# EAGLE design union (EAGLE 6.4)
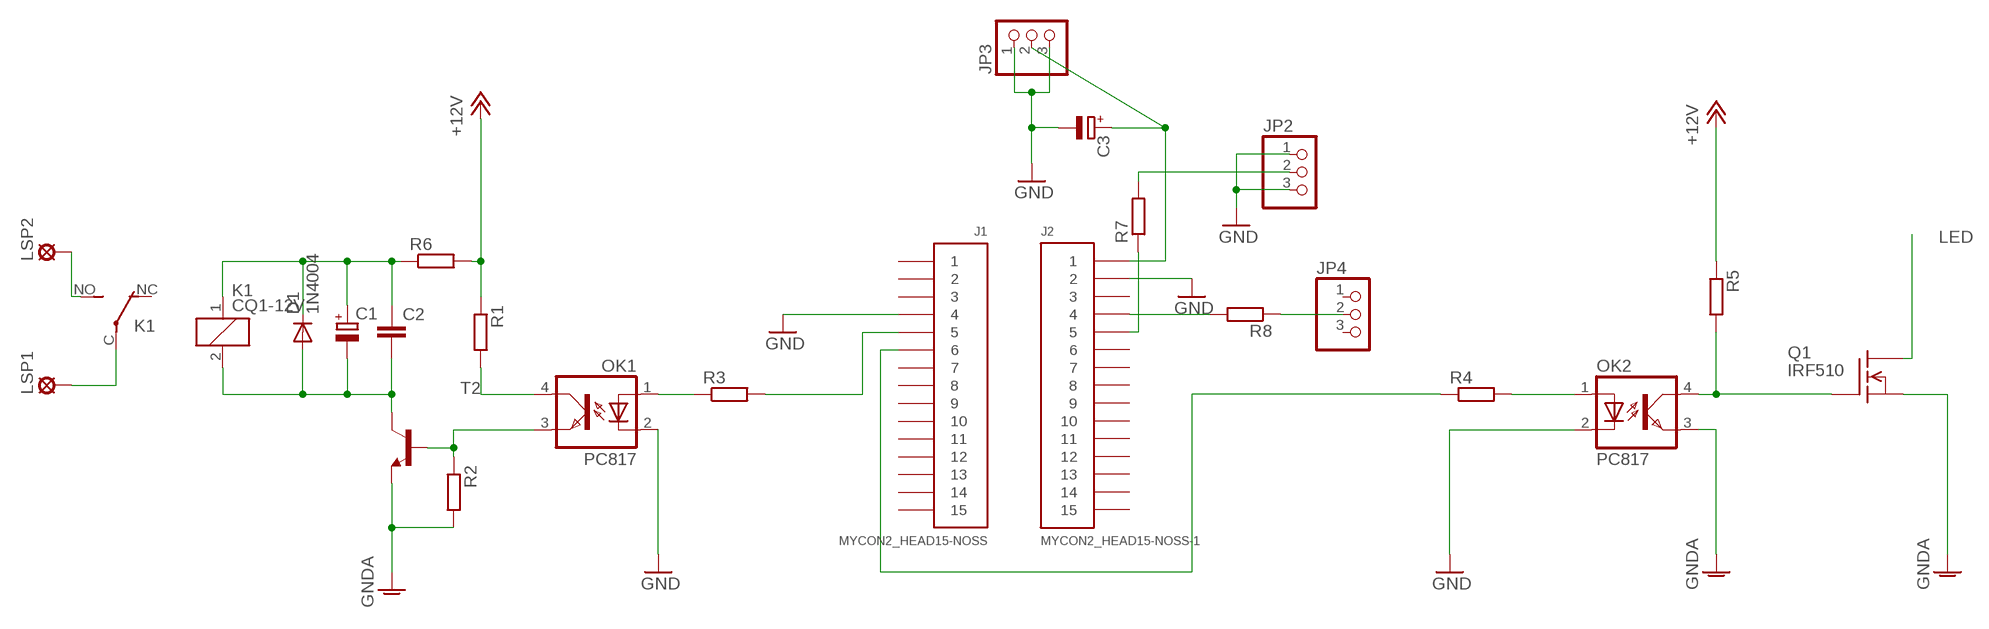
[diagram p0: schematic, sheet 1]

## Parts
C1  CPOL-EUE3.5-8  [E3,5-8]
C2  C-EUC1206  [C1206]
C3  CPOL-EUE3.5-8  [E3,5-8]
D1  1N4004  [DO41-10]
J1  MYCON2_HEAD15-NOSS  [MYCON2_HEAD15-NOSS]
J2  MYCON2_HEAD15-NOSS-1  [MYCON2_HEAD15-NOSS-1]
JP2  PINHD-1X3  [1X03]
JP3  PINHD-1X3  [1X03]
JP4  PINHD-1X3  [1X03]
K1  CQ1-12V  [CQ1]
LSP1  LSP10  [LSP10]
LSP2  LSP10  [LSP10]
OK1  PC817  [DIL04]
OK2  PC817  [DIL04]
Q1  IRF510  [TO220]
R1  R-EU_R1206  [R1206]
R2  R-EU_R1206  [R1206]
R3  R-EU_R1206  [R1206]
R4  R-EU_R1206  [R1206]
R5  R-EU_R1206  [R1206]
R6  R-EU_0204/5  [0204/5]
R7  R-EU_R1206  [R1206]
R8  R-EU_R1206  [R1206]
T2  -NPN-TO92  [TO92]

## Nets
+12V [lowpower]: R1.1 R5.1 R6.2
GND: C3.- J1.4 J2.2 JP2.1 JP2.3 JP3.1 JP3.3 OK1.2(C) OK2.2(C)
GNDA: OK2.3(EMIT) Q1.3(S) R2.2 T2.1(E)
LED [lowpower]: Q1.2(D)
N$1: OK1.3(EMIT) R2.1 T2.2(B)
N$2: C1.- C2.2 D1.A K1.2 T2.3(C)
N$3: OK1.4(COL) R1.2
N$4: OK1.1(A) R3.1
N$5: J1.6 R4.1
N$6 [power]: K1.C(2:P) LSP1.MP
N$7 [power]: K1.NO(2:S) LSP2.MP
N$8: OK2.4(COL) Q1.1(G) R5.2
N$9: OK2.1(A) R4.2
N$10: J1.5 R3.2
N$11 [lowpower]: C1.+ C2.1 D1.C K1.1 R6.1
N$12: JP2.2 R7.2
N$13: J2.4 R8.2
N$14: C3.+ J2.1 JP3.2
N$15: J2.5 R7.1
N$16: JP4.2 R8.1
Unconnected: J1.1 J1.2 J1.3 J1.7 J1.8 J1.9 J1.10 J1.11 J1.12 J1.13 J1.14 J1.15 J2.3 J2.6 J2.7 J2.8 J2.9 J2.10 J2.11 J2.12 J2.13 J2.14 J2.15 JP4.1 JP4.3 K1.NC(2:O)

## Library data of the parts
C1 C3 = rcl:CPOL-EU: POLARIZED CAPACITOR, European symbol
C2 = rcl:C-EU: CAPACITOR, European symbol
D1 = diode:1N4004: DIODE general purpose rectifier, 1 A
J1 = Arduino Nano2:MYCON2_HEAD15-NOSS
J2 = Arduino Nano2:MYCON2_HEAD15-NOSS-1
JP2-JP4 = pinhead:PINHD-1X3: PIN HEADER
K1 = relay:CQ1-12V: AUTOMOTIVE QUIET RELAY NAiS Source: http://www.mew-europe.com/.. en_ds_61208_0000.pdf; OC_FARNELL: unknown; OC_NEWARK: unknown
LSP1 LSP2 = solpad:LSP10: SOLDER PAD drill 1.0 mm, distributor Buerklin, 12H555
OK1 OK2 = optocoupler:PC817: SHARP OPTO COUPLER; MPN: PC817X4J000F; OC_FARNELL: 9707727; OC_NEWARK: 97K7059
Q1 = transistor-fet:IRF510: N-Channel Enhancement MOSFET (HEXFET); 100V; 5,6A; 0,54Ohm
R1-R5 R7 R8 = rcl:R-EU_: RESISTOR, European symbol
R6 = resistor:R-EU_: RESISTOR, European symbol
T2 = transistor:*-NPN-: NPN Transistror BF959 corrected 2008.03.06

## Net classes
0 default: width 0.559 mm
1 power: width 1.219 mm
2 lowpower: width 0.813 mm

## Board
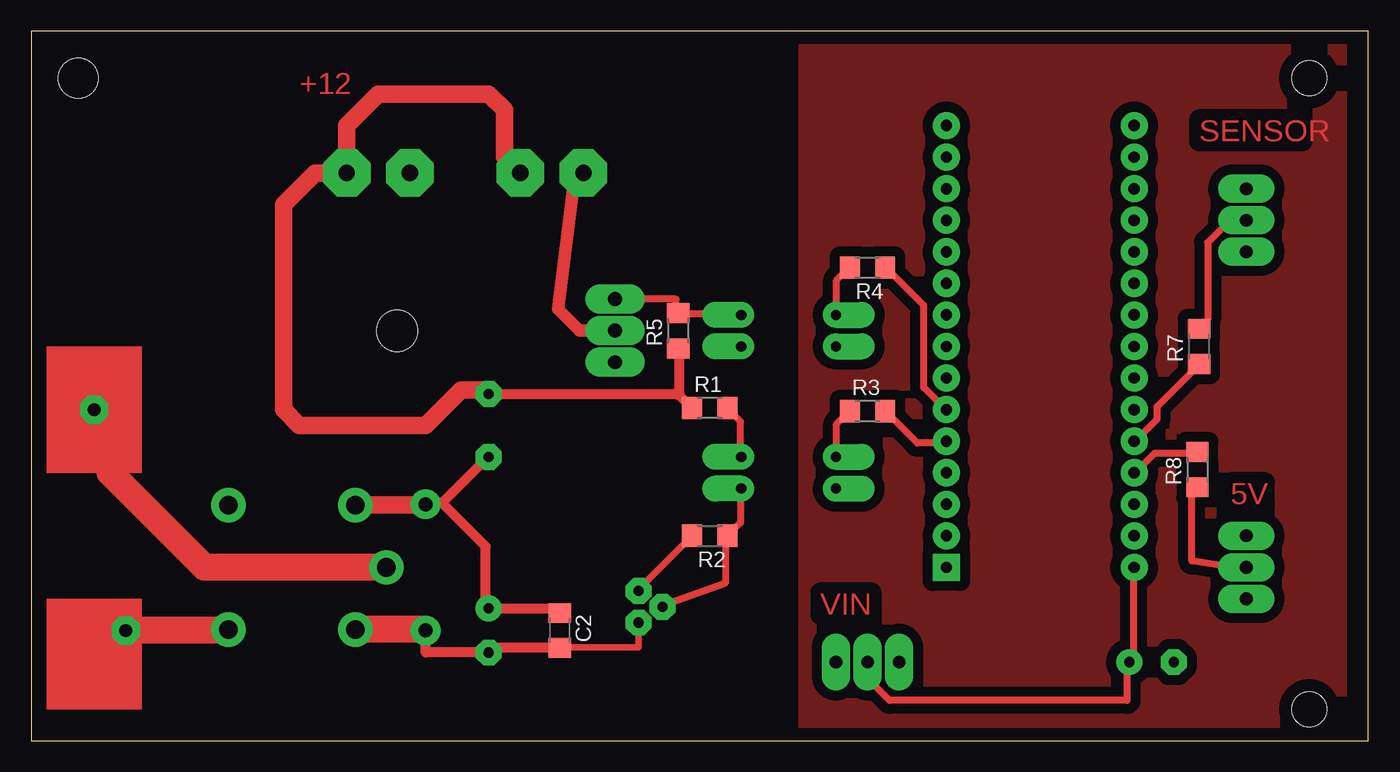
[diagram p1: board, top side]
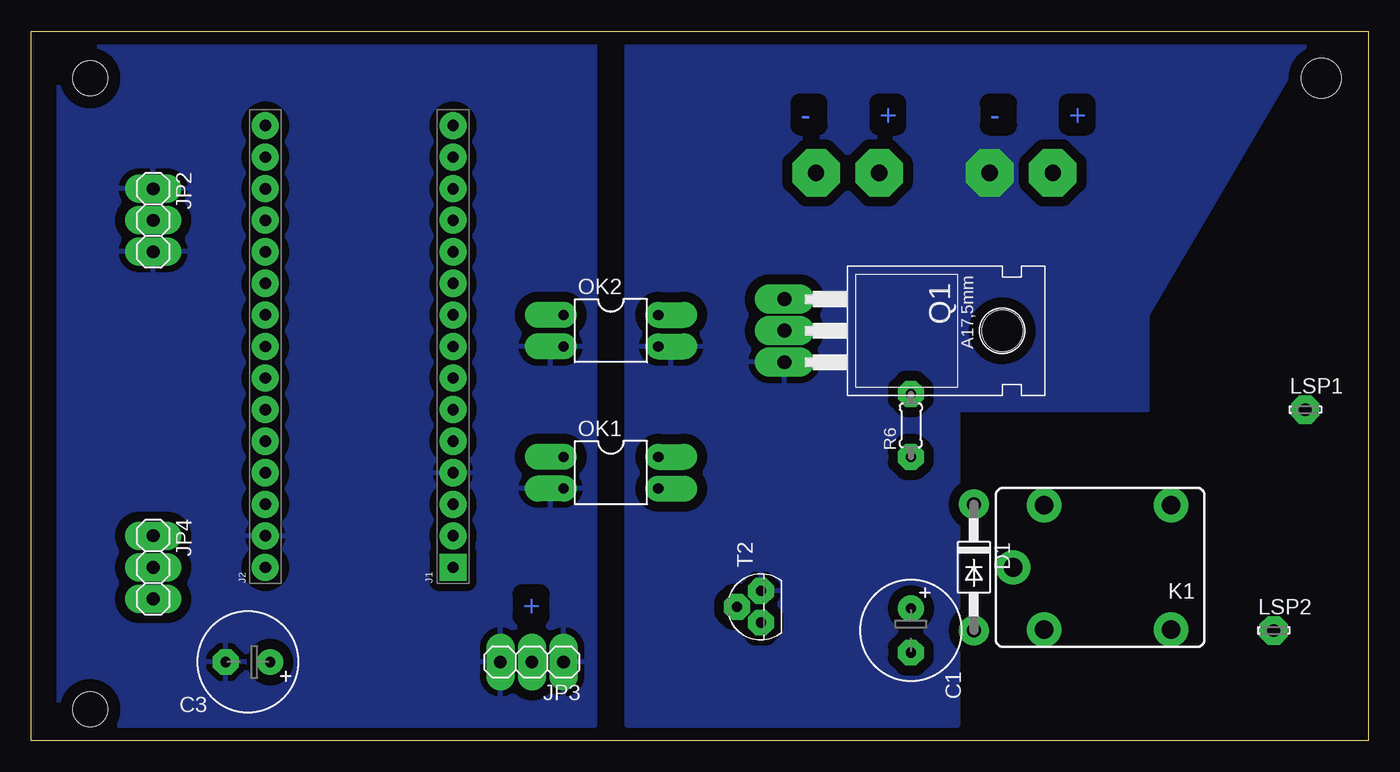
[diagram p2: board, bottom side, seen from below]

Size 107.62 x 57.14 mm. Coordinates in mm from the lower left corner, seen from the top.
Outline: 0,0 107.62,0 107.62,57.14 0,57.14 0,0
Copper layers (1*16): Top 0.035mm / dielectric 1.5mm / Bottom 0.035mm
Design rules "default *": minimum track width 18mil, minimum drill 32mil, track to track 18mil, track to pad 18mil, pad to pad 18mil, via to via 12mil, smd to smd 8mil, copper to edge 40mil, drill to drill 8mil, minimum pad ring 25mil, minimum via ring 12mil, stop-mask expansion 4mil, vias tented up to drill 0mil, thermal gap 20mil
Holes 2.8 mm at 102.87,53.34 102.87,2.54
Holes 3.2 mm at 3.81,53.34

### Footprints (pad centres in the part's own frame; a part is rotated, then mirrored left to right if it is on the bottom)
E3,5-8 = drill 0.813 pad 1.6: + -1.778,0 | drill 0.813 pad 1.6 octagon: - 1.778,0
C1206 = smd 1.6 x 1.8: 1 -1.4,0; 2 1.4,0
DO41-10 = drill 1.118: A 5.08,0; C -5.08,0
MYCON2_HEAD15-NOSS = drill 0.914 pad 1.778 square: 1 0,0 | drill 0.914 pad 1.778: 2 2.54,0; 3 5.08,0; 4 7.62,0; 5 10.16,0; 6 12.7,0; 7 15.24,0; 8 17.78,0; 9 20.32,0; 10 22.86,0; 11 25.4,0; 12 27.94,0; 13 30.48,0; 14 33.02,0; 15 35.56,0
MYCON2_HEAD15-NOSS-1 = drill 0.914 pad 1.778: 1 0,0; 2 2.54,0; 3 5.08,0; 4 7.62,0; 5 10.16,0; 6 12.7,0; 7 15.24,0; 8 17.78,0; 9 20.32,0; 10 22.86,0; 11 25.4,0; 12 27.94,0; 13 30.48,0; 14 33.02,0; 15 35.56,0
1X03 = drill 1.016 long: 1 -2.54,0; 2 0,0; 3 2.54,0
CQ1 = drill 1.5: 1 4.5,-5; 2 4.5,5; C 7,0; NC -5.7,-5; NO -5.7,5
LSP10 = drill 1.016 pad 2.159 octagon: MP 0,0
DIL04 = drill 0.813 offset: 1 -1.27,-3.81; 2 1.27,-3.81; 3 1.27,3.81; 4 -1.27,3.81
TO220 = drill 1.118 long: 1 -2.54,-6.35; 2 0,-6.35; 3 2.54,-6.35 | hole 3.302: 0,11.176
R1206 = smd 1.6 x 1.803: 1 -1.422,0; 2 1.422,0
0204/5 = drill 0.813 octagon: 1 -2.54,0; 2 2.54,0
TO92 = drill 0.813 octagon: 1 1.27,0; 2 0,1.905; 3 -1.27,0

### Placement (x,y rotation side)
C1  36.83,8.89 270 bottom
C2  42.55,8.89 270 top
C3  90.17,6.35 180 bottom
D1  31.75,13.97 270 bottom
J1  73.66,13.97 90 bottom
J2  88.77,13.97 90 bottom
JP2  97.79,41.91 270 bottom
JP3  67.31,6.35 180 bottom
JP4  97.79,13.97 270 bottom
K1  21.59,13.97 180 bottom
LSP1  5.08,26.67 0 bottom
LSP2  7.62,8.89 0 bottom
OK1  60.96,21.59 270 bottom
OK2  60.96,33.02 270 bottom
Q1  40.64,33.02 270 bottom
R1  54.61,26.8 0 top
R2  54.61,16.51 180 top
R3  67.31,26.54 0 top
R4  67.31,38.1 180 top
R5  52.07,33.02 90 top
R6  36.83,25.4 90 bottom
R7  93.98,31.75 90 top
R8  93.85,21.84 90 top
T2  48.9,10.79 90 bottom

### Tracks (layer width: path | path; a pad name or v marks a point on that pad's centre or on a via)
+12V  (via drill 1.3 pad 3.81)
  Top 0.813: 52.12,27.84 53.14,26.82 R1.1 | 52.12,27.84 52.12,31.6 R5.1 | 36.88,27.94 51.82,27.94 52.12,27.84 | 36.88,27.94 R6.2 | 36.88,27.94 36.58,28.25
  Top 1.422: 36.58,28.25 34.59,28.25 31.75,25.4 21.59,25.4 20.32,26.67 20.32,43.18 22.86,45.72 v25.4,45.72 25.4,49.53 27.94,52.07 36.83,52.07 38.1,50.8 38.1,46.99 v39.37,45.72
GND
  pour Bottom (isolate 0.813): 62.23,55.88 105.41,55.88 105.41,1.27 62.23,1.27
GNDA  (via drill 1.3 pad 3.81)
  Top 0.559: R2.2 53.14,16.46 48.97,12.29 48.97,12.09 T2.1
  other vias: 30.48,45.72
  pour Bottom (isolate 0.813): 5.08,55.88 59.69,55.88 59.69,1.27 33.02,1.27 33.02,26.67 17.78,26.67 17.78,34.29
LED  (via drill 1.3 pad 3.81)
  Top 0.813: 44.4,45.72 v44.45,45.72
  Top 1.016: 44.4,45.72 43.69,45.01 42.42,34.75 44.15,33.02 Q1.2
N$1
  Top 0.559: OK1.3 57.1,20.32 57.1,17.58 56.08,16.56 R2.1 55.98,16.26 55.98,16.05 55.88,16.05 55.88,12.7 50.8,10.87 T2.2
N$2
  Top 0.457: 26.16,8.99 K1.2 | 31.55,8.99 D1.A
  Top 0.508: C2.2 42.77,7.52 48.87,7.52 48.87,9.45 T2.3
  Top 0.61: 31.75,7.87 D1.A | 36.83,7.49 C1.-
  Top 0.813: C2.2 36.83,7.49 | C1.- 31.75,7.11 D1.A
  Top 2.184: 31.55,8.99 26.16,8.99
N$3
  Top 0.559: R1.2 56.08,26.72 57.1,25.7 57.1,22.86 OK1.4
N$4
  Top 0.559: R3.1 65.84,26.52 64.82,25.5 64.82,22.86 OK1.1
N$5
  Top 0.559: R4.1 68.78,38.1 71.83,35.05 71.83,28.45 73.66,26.62 J1.6
N$6
  Top 2.184: K1.C 13.97,13.97 6.35,21.59 6.35,25.4 LSP1.MP
N$7
  Top 1.219: 15.8,8.89 K1.NO
  Top 2.184: 15.8,8.89 LSP2.MP
N$8
  Top 0.559: OK2.4 57.1,34.34 52.12,34.34 R5.2 51.92,34.65 51.92,35.56 Q1.1
N$9
  Top 0.559: R4.2 65.84,38.1 64.82,37.08 64.82,34.34 OK2.1
N$10
  Top 0.559: J1.5 73.66,23.98 71.32,23.98 68.78,26.52 R3.2
N$11
  Top 0.61: 42.55,10.67 C2.1
  Top 0.813: 26.11,19 K1.1 | 31.39,19 D1.C 32.11,19.2 33.12,19.2 | 42.55,10.67 C1.+ 36.58,10.97 36.58,15.65 33.33,18.9 33.12,19.2 | 33.12,19.2 36.78,22.86 R6.1
  Top 1.422: 31.39,19 26.11,19
N$12
  Top 0.559: R7.2 93.98,33.22 94.69,33.93 94.69,40.13 96.42,41.86 97.74,41.86 JP2.2
N$13
  Top 0.559: R8.2 93.78,23.16 90.42,23.16 88.8,21.54 J2.4
N$14
  Top 0.559: J2.1 88.7,13.92 88.7,6.71 88.39,6.4 C3.+ 88.19,6.2 88.19,3.25 69.09,3.25 67.97,4.37 67.97,5.69 JP3.2
N$15
  Top 0.559: R7.1 93.98,30.28 90.63,26.92 90.63,25.91 88.8,24.08 J2.5
N$16
  Top 0.559: R8.1 93.88,20.42 93.42,19.61 93.42,14.48 96.42,14.02 97.74,14.02 JP4.2
N$17
  pour Top (isolate 0.813): 62.23,55.88 105.41,55.88 105.41,1.27 62.23,1.27
(copper drawn outside any net)
  shapes: Top area x2

### Text on the board
Top: +12 | SENSOR | 5V | VIN
Bottom: + | - | + | - | +